# EAGLE schematic HumanoidArduino (EAGLE 7.7.0)

## Sheet 1 of 2
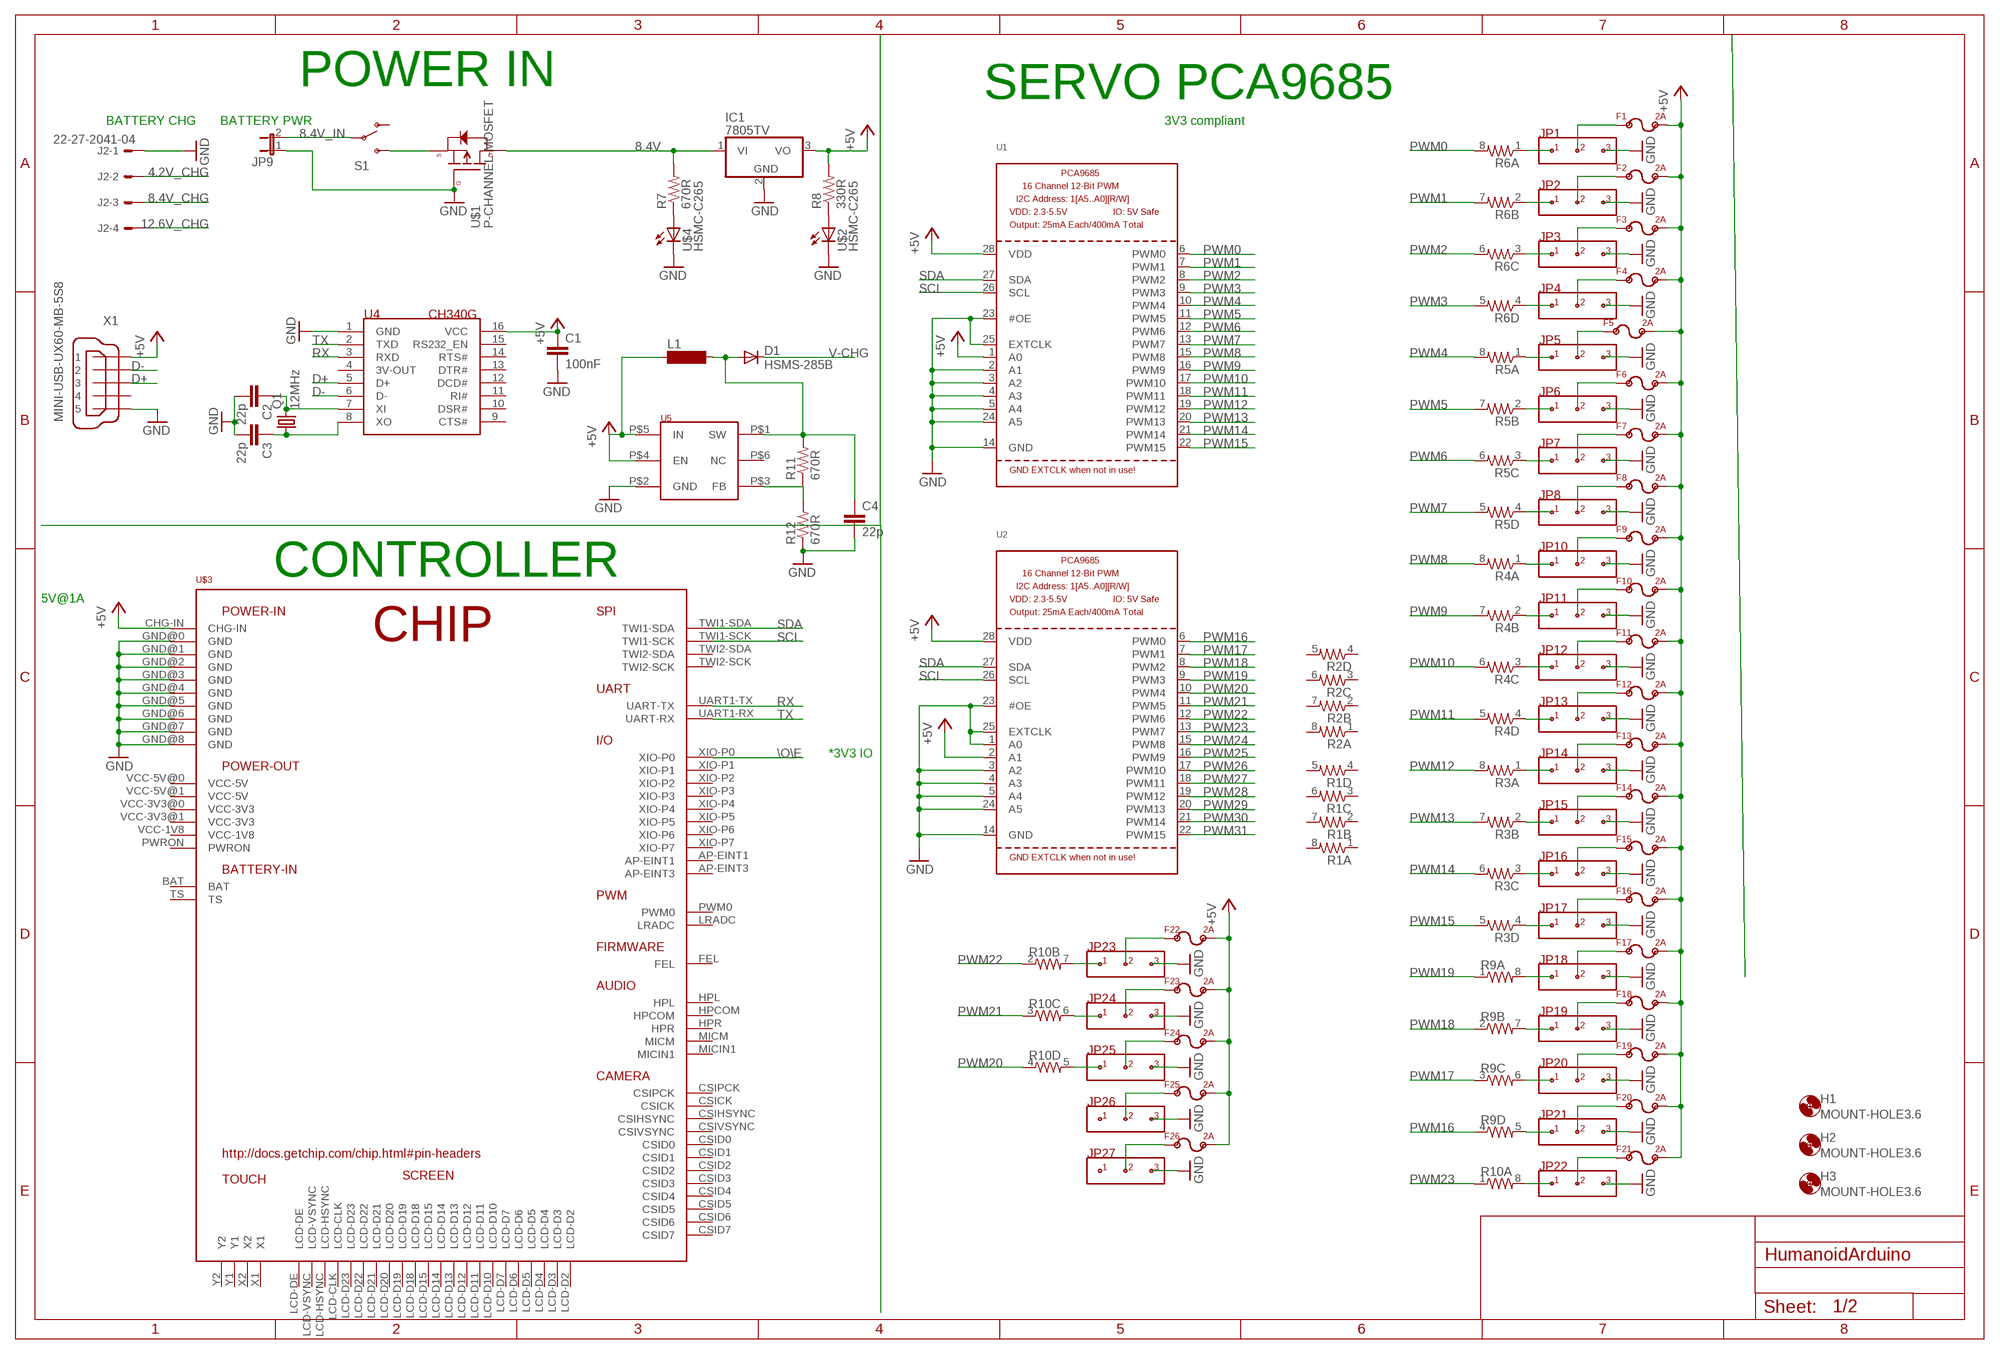
[diagram p0: schematic, sheet 1]

### Parts
C1  100nF  C2,5-3  [C2.5-3]
C2  22p  C2,5-3  [C2.5-3]
C3  22p  C2,5-3  [C2.5-3]
C4  22p  C2,5-3  [C2.5-3]
D1  HSMS-285B  [SOT323]
F1  POLYSWITCH  [1206]
F2  POLYSWITCH  [1206]
F3  POLYSWITCH  [1206]
F4  POLYSWITCH  [1206]
F5  POLYSWITCH  [1206]
F6  POLYSWITCH  [1206]
F7  POLYSWITCH  [1206]
F8  POLYSWITCH  [1206]
F9  POLYSWITCH  [1206]
F10  POLYSWITCH  [1206]
F11  POLYSWITCH  [1206]
F12  POLYSWITCH  [1206]
F13  POLYSWITCH  [1206]
F14  POLYSWITCH  [1206]
F15  POLYSWITCH  [1206]
F16  POLYSWITCH  [1206]
F17  POLYSWITCH  [1206]
F18  POLYSWITCH  [1206]
F19  POLYSWITCH  [1206]
F20  POLYSWITCH  [1206]
F21  POLYSWITCH  [1206]
F22  POLYSWITCH  [1206]
F23  POLYSWITCH  [1206]
F24  POLYSWITCH  [1206]
F25  POLYSWITCH  [1206]
F26  POLYSWITCH  [1206]
H1  MOUNT-HOLE3.6  [3,6]
H2  MOUNT-HOLE3.6  [3,6]
H3  MOUNT-HOLE3.6  [3,6]
IC1  7805TV  [TO220V]
J2  22-27-2041-04  [6410-04]
JP1  JUMPER_3X1_0.1  [CONN_3X1_0.1"]
JP2  JUMPER_3X1_0.1  [CONN_3X1_0.1"]
JP3  JUMPER_3X1_0.1  [CONN_3X1_0.1"]
JP4  JUMPER_3X1_0.1  [CONN_3X1_0.1"]
JP5  JUMPER_3X1_0.1  [CONN_3X1_0.1"]
JP6  JUMPER_3X1_0.1  [CONN_3X1_0.1"]
JP7  JUMPER_3X1_0.1  [CONN_3X1_0.1"]
JP8  JUMPER_3X1_0.1  [CONN_3X1_0.1"]
JP9  JP1E  [JP1]
JP10  JUMPER_3X1_0.1  [CONN_3X1_0.1"]
JP11  JUMPER_3X1_0.1  [CONN_3X1_0.1"]
JP12  JUMPER_3X1_0.1  [CONN_3X1_0.1"]
JP13  JUMPER_3X1_0.1  [CONN_3X1_0.1"]
JP14  JUMPER_3X1_0.1  [CONN_3X1_0.1"]
JP15  JUMPER_3X1_0.1  [CONN_3X1_0.1"]
JP16  JUMPER_3X1_0.1  [CONN_3X1_0.1"]
JP17  JUMPER_3X1_0.1  [CONN_3X1_0.1"]
JP18  JUMPER_3X1_0.1  [CONN_3X1_0.1"]
JP19  JUMPER_3X1_0.1  [CONN_3X1_0.1"]
JP20  JUMPER_3X1_0.1  [CONN_3X1_0.1"]
JP21  JUMPER_3X1_0.1  [CONN_3X1_0.1"]
JP22  JUMPER_3X1_0.1  [CONN_3X1_0.1"]
JP23  JUMPER_3X1_0.1  [CONN_3X1_0.1"]
JP24  JUMPER_3X1_0.1  [CONN_3X1_0.1"]
JP25  JUMPER_3X1_0.1  [CONN_3X1_0.1"]
JP26  JUMPER_3X1_0.1  [CONN_3X1_0.1"]
JP27  JUMPER_3X1_0.1  [CONN_3X1_0.1"]
L1  SM-1206  [SM-1206]
Q1  12MHz  CSM-7X-DU  [CSM-7X-DU]
R1  RESISTOR-ARRAY0603-ARV  [0603-ARV]
R2  RESISTOR-ARRAY0603-ARV  [0603-ARV]
R3  RESISTOR-ARRAY0603-ARV  [0603-ARV]
R4  RESISTOR-ARRAY0603-ARV  [0603-ARV]
R5  RESISTOR-ARRAY0603-ARV  [0603-ARV]
R6  RESISTOR-ARRAY0603-ARV  [0603-ARV]
R7  670R  RESISTOR0805-RES  [0805]
R8  330R  RESISTOR0805-RES  [0805]
R9  RESISTOR-ARRAY0603-ARV  [0603-ARV]
R10  RESISTOR-ARRAY0603-ARV  [0603-ARV]
R11  670R  RESISTOR0805-RES  [0805]
R12  670R  RESISTOR0805-RES  [0805]
S1  SWITCH-SPDTPTH_LOCK  [SWITCH-SPDT_LOCK.007S]
U1  PCA9685  [TSSOP28]
U2  PCA9685  [TSSOP28]
U4  CH340G  [SO-16]
U5  SX1308_B628  [SOT23-6]
U$1  P-CHANNEL-MOSFET  [SOT23-3]
U$2  HSMC-C265  [HSMC-C265]
U$3  CHIP  [CHIP]
U$4  HSMC-C265  [HSMC-C265]
X1  MINI-USB-UX60-MB-5S8  [UX60-MB-5S8]

### Nets
4.2V_CHG: J2.2
8.4V: IC1.1(VI) R7.2 U$1.3(D)
8.4V_CHG: J2.3
8.4V_IN: JP9.2 S1.2(P)
12.6V_CHG: J2.4
+5V: C1.1 F1.P$2 F2.P$2 F3.P$2 F4.P$2 F5.P$2 F6.P$2 F7.P$2 F8.P$2 F9.P$2 F10.P$2 F11.P$2 F12.P$2 F13.P$2 F14.P$2 F15.P$2 F16.P$2 F17.P$2 F18.P$2 F19.P$2 F20.P$2 F21.P$2 F22.P$2 F23.P$2 F24.P$2 F25.P$2 F26.P$2 IC1.3(VO) R8.2 U1.1(A0) U1.28(VDD) U2.2(A1) U2.28(VDD) U4.16(VCC) U$3.CHG-IN X1.1
\O\E: U$3.XIO-P0
D+: U4.5(D+) X1.3
D-: U4.6(D-) X1.2
GND: C1.2 C2.2 C3.2 C4.2 IC1.2(GND) J2.1 JP1.P$3 JP2.P$3 JP3.P$3 JP4.P$3 JP9.1 JP18.P$3 JP19.P$3 JP20.P$3 JP21.P$3 JP22.P$3 JP23.P$3 JP24.P$3 JP25.P$3 JP26.P$3 JP27.P$3 R12.1 U1.2(A1) U1.3(A2) U1.4(A3) U1.5(A4) U1.14(GND) U1.23(#OE) U1.24(A5) U1.25(EXTCLK) U2.1(A0) U2.3(A2) U2.4(A3) U2.5(A4) U2.14(GND) U2.23(#OE) U2.24(A5) U2.25(EXTCLK) U4.1(GND) U5.P$2(GND) U$1.1(G) U$2.C U$3.GND@0(GND) U$3.GND@1(GND) U$3.GND@2(GND) U$3.GND@3(GND) U$3.GND@4(GND) U$3.GND@5(GND) U$3.GND@6(GND) U$3.GND@7(GND) U$3.GND@8(GND) U$4.C X1.5
N$2: JP1.P$1 R6.1
N$3: JP2.P$1 R6.2
N$4: JP3.P$1 R6.3
N$5: JP4.P$1 R6.4
N$6: F3.P$1 JP3.P$2
N$7: F4.P$1 JP4.P$2
N$8: F16.P$1 JP17.P$2
N$9: F15.P$1 JP16.P$2
N$10: F14.P$1 JP15.P$2
N$11: F13.P$1 JP14.P$2
N$12: F12.P$1 JP13.P$2
N$13: F11.P$1 JP12.P$2
N$14: F10.P$1 JP11.P$2
N$15: F9.P$1 JP10.P$2
N$16: F8.P$1 JP8.P$2
N$17: F7.P$1 JP7.P$2
N$18: F6.P$1 JP6.P$2
N$19: F5.P$1 JP5.P$2
N$20: JP5.P$1 R5.1
N$21: JP6.P$1 R5.2
N$22: JP7.P$1 R5.3
N$23: JP8.P$1 R5.4
N$24: JP10.P$1 R4.1
N$25: JP11.P$1 R4.2
N$26: S1.3(S) U$1.2(S)
N$27: F1.P$1 JP1.P$2
N$28: R7.1 U$4.A
N$29: R8.1 U$2.A
N$30: F2.P$1 JP2.P$2
N$31: JP12.P$1 R4.3
N$32: JP13.P$1 R4.4
N$33: JP14.P$1 R3.1
N$34: JP15.P$1 R3.2
N$35: JP16.P$1 R3.3
N$36: JP17.P$1 R3.4
N$38: F21.P$1 JP22.P$2
N$39: F20.P$1 JP21.P$2
N$40: F19.P$1 JP20.P$2
N$41: F18.P$1 JP19.P$2
N$42: F17.P$1 JP18.P$2
N$43: JP18.P$1 R9.8
N$44: JP19.P$1 R9.7
N$45: JP20.P$1 R9.6
N$46: JP21.P$1 R9.5
N$47: JP22.P$1 R10.8
N$48: F22.P$1 JP23.P$2
N$49: F23.P$1 JP24.P$2
N$50: F24.P$1 JP25.P$2
N$51: F25.P$1 JP26.P$2
N$52: F26.P$1 JP27.P$2
N$53: JP23.P$1 R10.7
N$54: JP24.P$1 R10.6
N$55: JP25.P$1 R10.5
N$56: C2.1 Q1.2 U4.7(XI)
N$57: C3.1 Q1.1 U4.8(XO)
N$58: L1.1 U5.P$4(EN) U5.P$5(IN)
N$59: R12.2 U5.P$3(FB)
N$60: C4.1 D1.1(A) L1.2 R11.2 U5.P$1(SW)
PWM0: R6.8 U1.6(PWM0)
PWM1: R6.7 U1.7(PWM1)
PWM2: R6.6 U1.8(PWM2)
PWM3: R6.5 U1.9(PWM3)
PWM4: R5.8 U1.10(PWM4)
PWM5: R5.7 U1.11(PWM5)
PWM6: R5.6 U1.12(PWM6)
PWM7: R5.5 U1.13(PWM7)
PWM8: R4.8 U1.15(PWM8)
PWM9: R4.7 U1.16(PWM9)
PWM10: R4.6 U1.17(PWM10)
PWM11: R4.5 U1.18(PWM11)
PWM12: R3.8 U1.19(PWM12)
PWM13: R3.7 U1.20(PWM13)
PWM14: R3.6 U1.21(PWM14)
PWM15: R3.5 U1.22(PWM15)
PWM16: R9.4 U2.6(PWM0)
PWM17: R9.3 U2.7(PWM1)
PWM18: R9.2 U2.8(PWM2)
PWM19: R9.1 U2.9(PWM3)
PWM20: R10.4 U2.10(PWM4)
PWM21: R10.3 U2.11(PWM5)
PWM22: U2.12(PWM6)
PWM23: R10.1 U2.13(PWM7)
PWM24: U2.15(PWM8)
PWM25: U2.16(PWM9)
PWM26: U2.17(PWM10)
PWM27: U2.18(PWM11)
PWM28: U2.19(PWM12)
PWM29: U2.20(PWM13)
PWM30: U2.21(PWM14)
PWM31: U2.22(PWM15)
RX: U4.3(RXD) U$3.UART1-TX(UART-TX)
SCL: U1.26(SCL) U2.26(SCL) U$3.TWI1-SCK
SDA: U1.27(SDA) U2.27(SDA) U$3.TWI1-SDA
TX: U4.2(TXD) U$3.UART1-RX(UART-RX)
V-CHG: D1.3(C)
Unconnected: JP5.P$3 JP6.P$3 JP7.P$3 JP8.P$3 JP10.P$3 JP11.P$3 JP12.P$3 JP13.P$3 JP14.P$3 JP15.P$3 JP16.P$3 JP17.P$3 JP26.P$1 JP27.P$1 R1.1 R1.2 R1.3 R1.4 R1.5 R1.6 R1.7 R1.8 R2.1 R2.2 R2.3 R2.4 R2.5 R2.6 R2.7 R2.8 R10.2 R11.1 S1.1(O) U4.4(3V-OUT) U4.9(CTS#) U4.10(DSR#) U4.11(RI#) U4.12(DCD#) U4.13(DTR#) U4.14(RTS#) U4.15(RS232_EN) U5.P$6(NC) U$3.AP-EINT1 U$3.AP-EINT3 U$3.BAT U$3.CSICK U$3.CSID0 U$3.CSID1 U$3.CSID2 U$3.CSID3 U$3.CSID4 U$3.CSID5 U$3.CSID6 U$3.CSID7 U$3.CSIHSYNC U$3.CSIPCK U$3.CSIVSYNC U$3.FEL U$3.HPCOM U$3.HPL U$3.HPR U$3.LCD-CLK U$3.LCD-D2 U$3.LCD-D3 U$3.LCD-D4 U$3.LCD-D5 U$3.LCD-D6 U$3.LCD-D7 U$3.LCD-D10 U$3.LCD-D11 U$3.LCD-D12 U$3.LCD-D13 U$3.LCD-D14 U$3.LCD-D15 U$3.LCD-D18 U$3.LCD-D19 U$3.LCD-D20 U$3.LCD-D21 U$3.LCD-D22 U$3.LCD-D23 U$3.LCD-DE U$3.LCD-HSYNC U$3.LCD-VSYNC U$3.LRADC U$3.MICIN1 U$3.MICM U$3.PWM0 U$3.PWRON U$3.TS U$3.TWI2-SCK U$3.TWI2-SDA U$3.VCC-1V8 U$3.VCC-3V3@0(VCC-3V3) U$3.VCC-3V3@1(VCC-3V3) U$3.VCC-5V@0(VCC-5V) U$3.VCC-5V@1(VCC-5V) U$3.X1 U$3.X2 U$3.XIO-P1 U$3.XIO-P2 U$3.XIO-P3 U$3.XIO-P4 U$3.XIO-P5 U$3.XIO-P6 U$3.XIO-P7 U$3.Y1 U$3.Y2 X1.4

### Notes on the sheet
- POWER IN | SERVO PCA9685
- BATTERY CHG | BATTERY PWR | ￼ ✓ 3V3 compliant
- CONTROLLER
- 5V@1A
- *3V3 IO

## Sheet 2 of 2
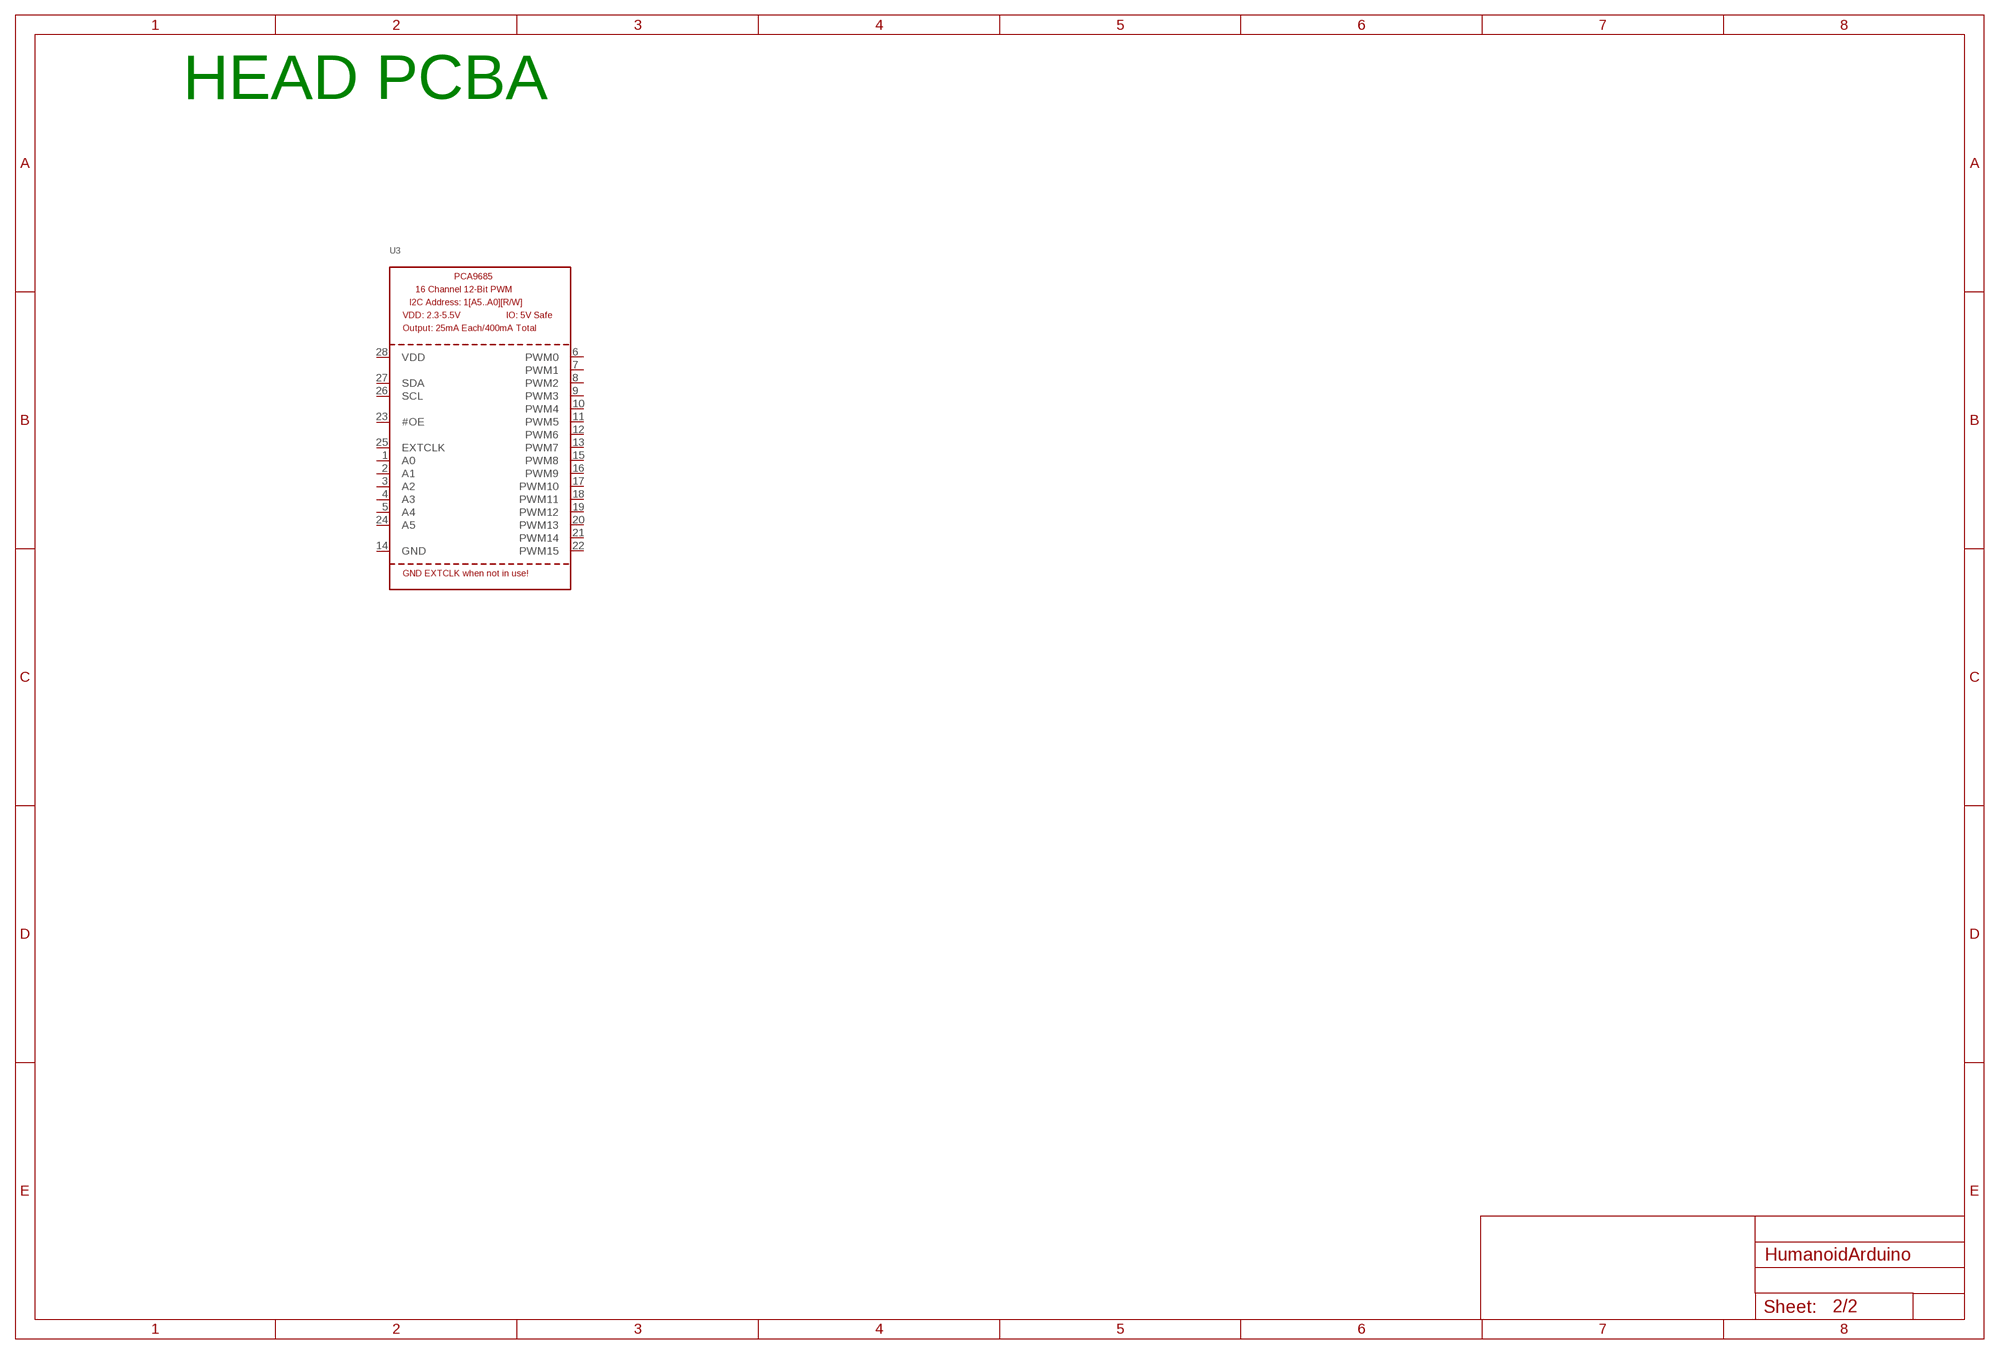
[diagram p1: schematic, sheet 2]

### Parts
U3  PCA9685  [TSSOP28]
Unconnected: U3.1(A0) U3.2(A1) U3.3(A2) U3.4(A3) U3.5(A4) U3.6(PWM0) U3.7(PWM1) U3.8(PWM2) U3.9(PWM3) U3.10(PWM4) U3.11(PWM5) U3.12(PWM6) U3.13(PWM7) U3.15(PWM8) U3.16(PWM9) U3.17(PWM10) U3.18(PWM11) U3.19(PWM12) U3.20(PWM13) U3.21(PWM14) U3.22(PWM15) U3.23(#OE) U3.24(A5) U3.25(EXTCLK) U3.26(SCL) U3.27(SDA)

### Notes on the sheet
- HEAD PCBA

## Power pins joined to a net without a drawn wire
GND: U3.14(GND)
VDD: U3.28(VDD)

## Library data of the parts
C1-C4 = capacitor-wima:C: CAPACITOR naming: grid - package width
D1 = avago:HSMS-285B: Surface Mount Microwave Schottky Detector Diodes Source: Data sheet <http://www.farnell.com/datasheets/461166.pdf>
F1-F26 = HumanoidLbr:POLYSWITCH; CURRENT: 2A
H1-H3 = holes:MOUNT-HOLE: MOUNTING HOLE with drill center marker
IC1 = linear:78*: Positive VOLTAGE REGULATOR Source: http://cache.national.com/ds/LM/LM78L05.pdf http://www.fairchildsemi.com/ds/LM/LM7805.pdf
J2 = con-molex:22-?-04: CONNECTOR wire to board 2.54 mm (.1 inch) pitch header; OC_FARNELL: unknown; OC_NEWARK: unknown
JP1-JP8 JP10-JP27 = HumanoidLbr:JUMPER_3X1_0.1
JP9 = jumper:JP1E: JUMPER
L1 = inductor-neosid:SM-1206: INDUCTOR SMD chip inductor; OC_FARNELL: unknown; OC_NEWARK: unknown
Q1 = crystal:CSM-7X-DU: SMD CRYSTAL Source: www.ecsxtal.com .. Crystal 3.6864MHz CSM_7X_DU.PDF; OC_FARNELL: unknown; OC_NEWARK: unknown
R1-R6 R9 R10 = SparkFun-Resistors:RESISTOR-ARRAY: Array Chip Resistor Source: RS Component / Phycomp
R7 R8 R11 R12 = SparkFun-Passives:RESISTOR: Resistor Basic schematic elements and footprints for 0603, 1206, and PTH resistors.
S1 = SparkFun-Electromechanical:SWITCH-SPDT: SPDT Switch Simple slide switch, Spark Fun Electronics SKU : COM-00102 DPDT SMT slide switch, AYZ0202, SWCH-08179
U1-U3 = adafruit:PCA9685: PCA9685 - 16 Channel 12-Bit I2C PWM Controller 5.0V tolerant 16 channel, 12-bit I2C PWM controller with 25mA per output (max. 400mA total) Digikey: 568-5931-1-ND
U4 = HumanoidLbr:CH340G
U5 = HumanoidLbr:SX1308_B628
U$1 = GeekAmmo:P-CHANNEL-MOSFET: P-Channel MOSFET Mode Field Effect Transistor
U$2 U$4 = SparkFun-Retired:HSMC-C265: RETIRED Avago HSMC-C265 reverse-mounted red LED This is a SMD LED that is mounted to one side of a PCB and shines through a hole to the other side of the PCB. Useful for making boards with no components on one side for mounting and having LED indicator lights shine through the board, panel, etc.
U$3 = ZMZE:CHIP
X1 = con-hirose:MINI-USB-: MINI USB Connector Source: http://www.hirose.co.jp/cataloge_hp/e24000019.pdf; OC_FARNELL: unknown; OC_NEWARK: unknown